# Altium schematic sheet STRWL-S04-V00-Microcontroller.SchDoc: STRWL Microcontroller
size A3; DrawnBy: John Hatfield; DocumentNumber: 4; Revision: 01; SheetNumber: 4; SheetTotal: 6; Version: 01; Project: STRWL QEV3; PageSetup: Record=PageOptions|CenterHorizontal=True|CenterVertical=True|PrintScale=0.97|XCorrection=1.00|YCorrection=1.00|PrintKind=0|BorderSize=5000000|LeftOffset=0|BottomOffset=0|Orientation=2|PaperLength=1000|PaperWidth=1000|Scale=100|PaperSource=7|PrintQuality=-4|MediaType=1|DitherType=10|PaperKind=A4|PrintScaleMode=1
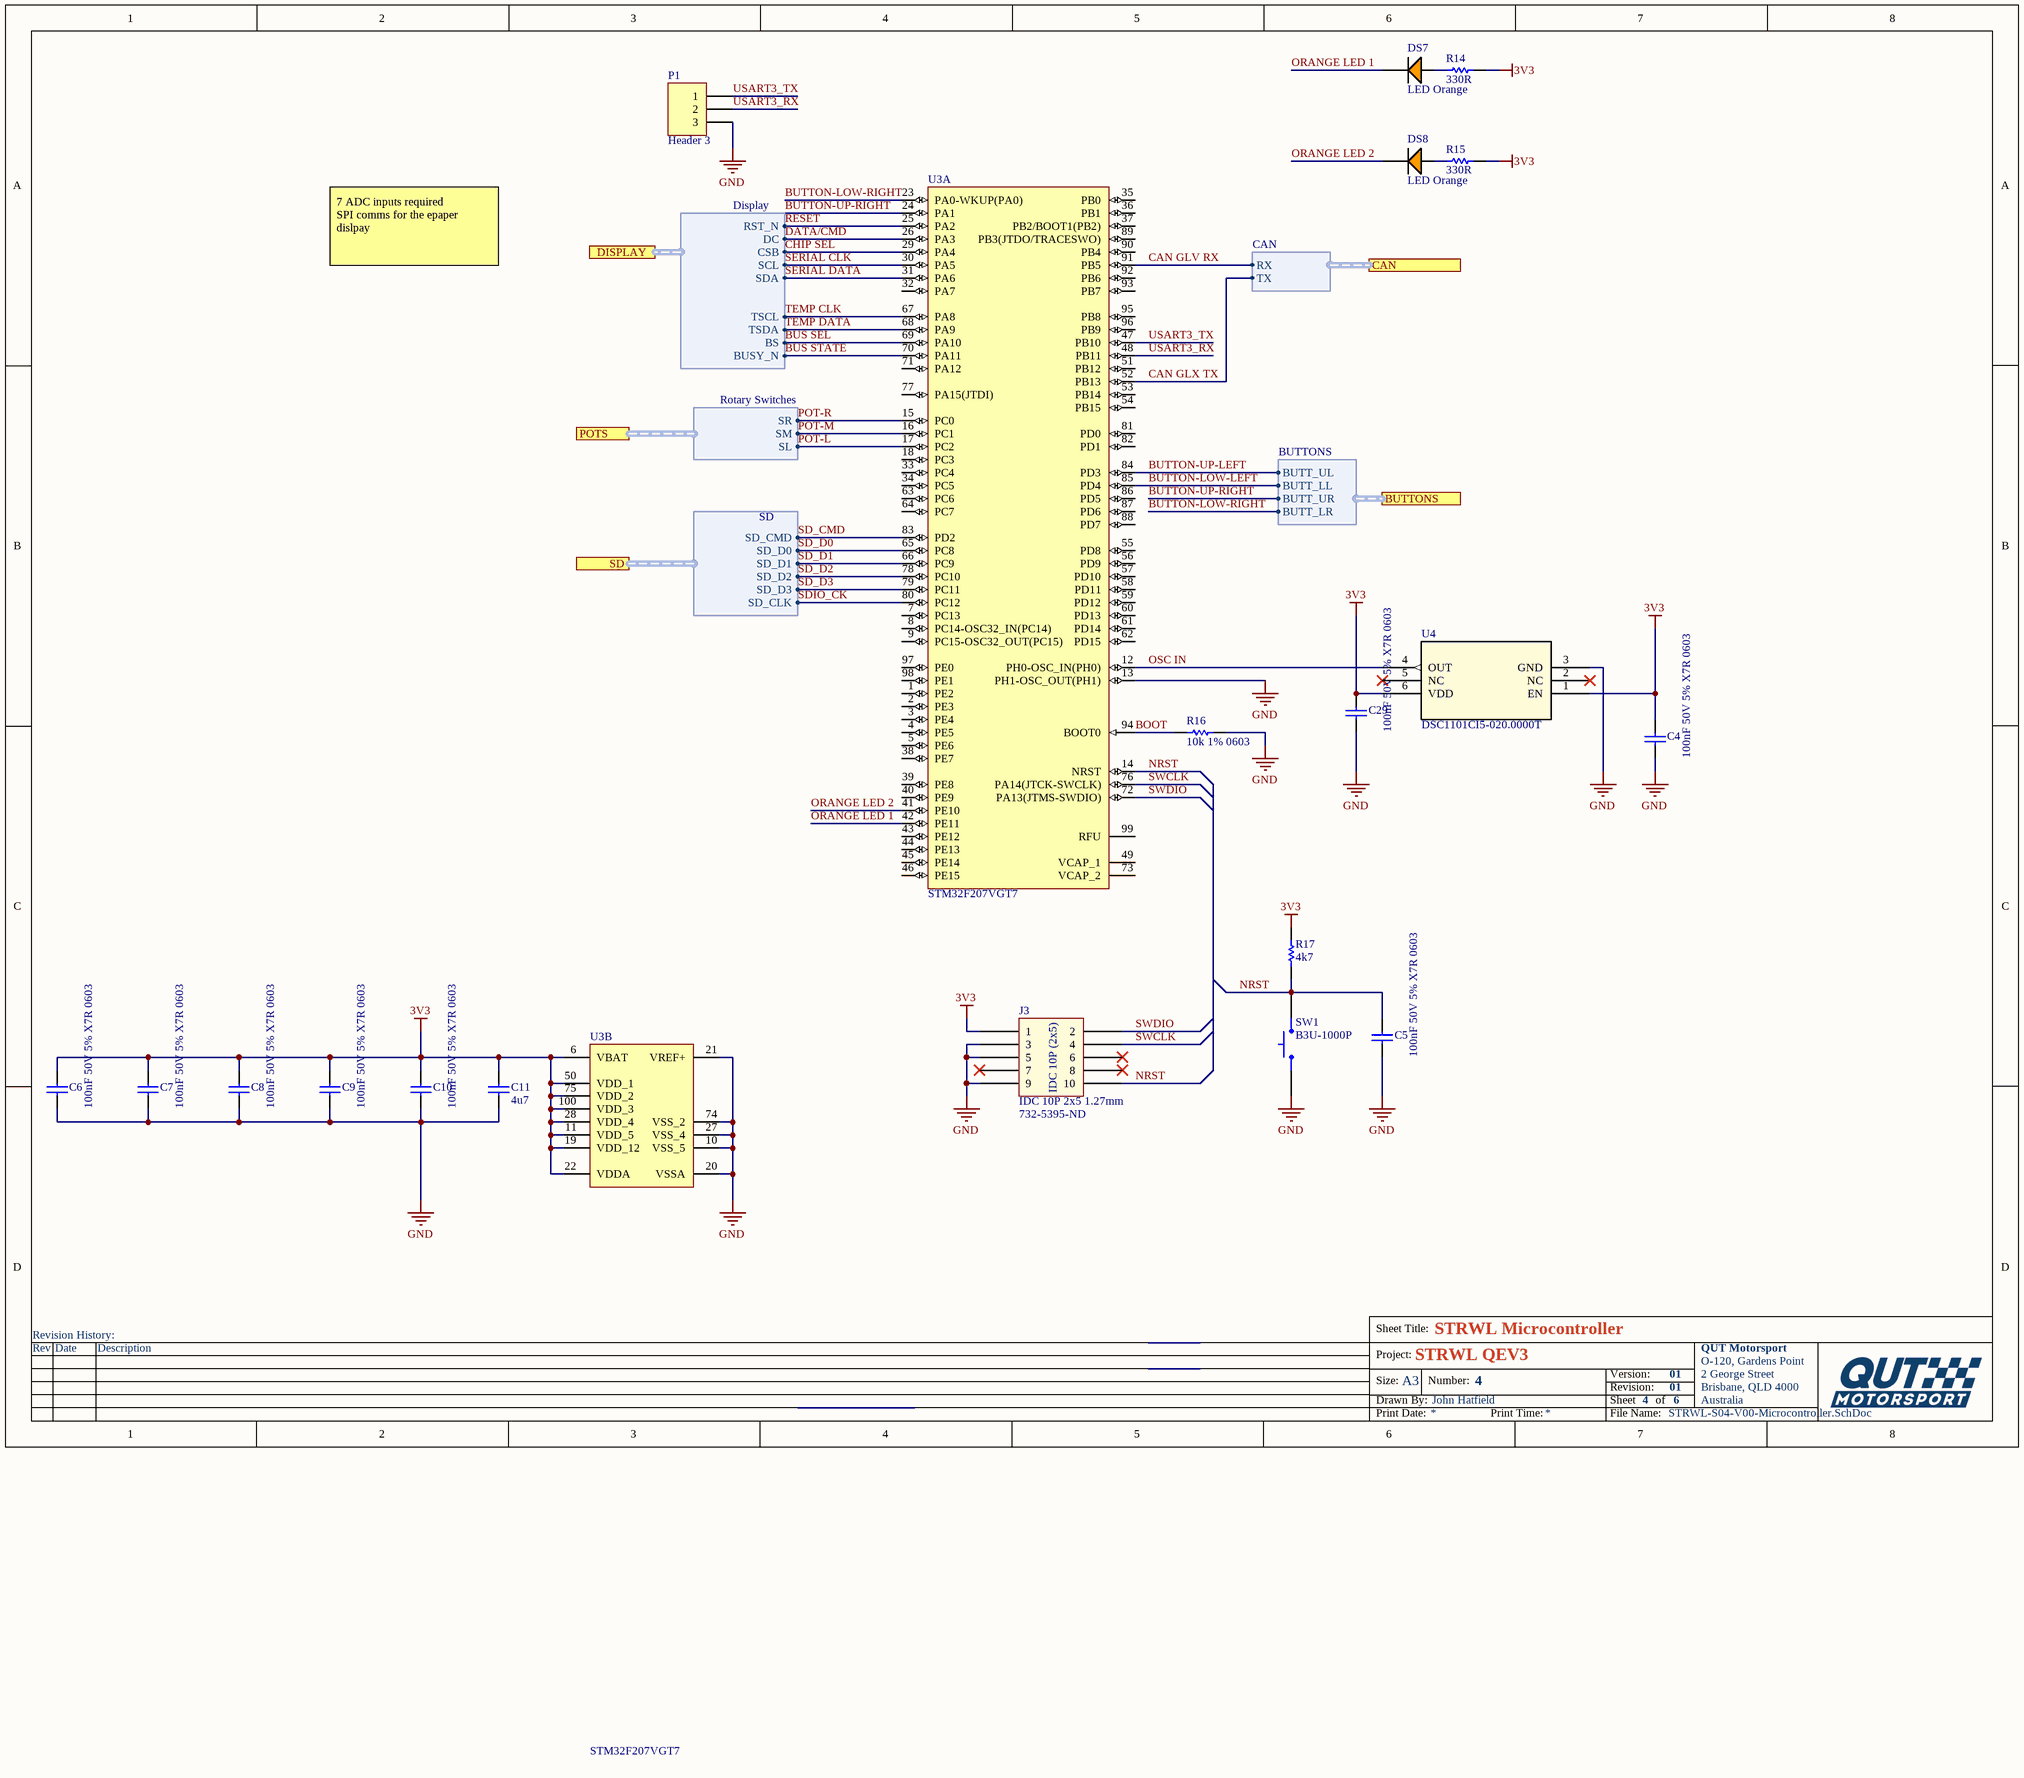
[diagram p0: STRWL-S04-V00-Microcontroller.SchDoc]

## Parts
C4  100nF 50V 5% X7R 0603  [Cap_Ceramic_0603]
C5  100nF 50V 5% X7R 0603  [Cap_Ceramic_0603]
C6  100nF 50V 5% X7R 0603  [Cap_Ceramic_0603]
C7  100nF 50V 5% X7R 0603  [Cap_Ceramic_0603]
C8  100nF 50V 5% X7R 0603  [Cap_Ceramic_0603]
C9  100nF 50V 5% X7R 0603  [Cap_Ceramic_0603]
C10  100nF 50V 5% X7R 0603  [Cap_Ceramic_0603]
C11  4u7  [Cap_Ceramic_0603]
C29  100nF 50V 5% X7R 0603  [Cap_Ceramic_0603]
DS7  LED Orange  [LED ORANGE 0603]
DS8  LED Orange  [LED ORANGE 0603]
J3  IDC 10P 2x5 1.27mm  [IDC 1.27MM 10P]
P1  Header 3  [HDR1X3]
R14  330R  [Res_ThinFilm_0603]
R15  330R  [Res_ThinFilm_0603]
R16  10k 1% 0603  [Res_ThinFilm_0603]
R17  4k7  [Res_ThinFilm_0603]
SW1  B3U-1000P  [BTN B3U-1000P]
U3  STM32F207VGT7  [STM-LQFP100_N]  (parts A,B of 2)
U4  DSC1101CI5-020.0000T  [VDFN6_3P2X2P5_MCH]

## Ports
BUTTONS (harness BUTTONS), CAN (harness CAN), DISPLAY (harness Display), POTS (harness Rotary Switches), SD (harness SD)

## Harnesses
SD: SD_D0, SD_D1, SD_D2, SD_D3, SD_CLK, SD_CMD
Display: RST_N, DC, CSB, SCL, SDA, TSCL, TSDA, BS, BUSY_N
BUTTONS: BUTT_UL, BUTT_LL, BUTT_UR, BUTT_LR
Rotary Switches: SL, SM, SR
CAN: RX, TX

## Nets
3V3: C4.2 C6.2 C7.2 C8.2 C9.2 C10.2 C11.2 C29.2 J3.1 R14.2 R15.2 R17.2 U3.6(VBAT) U3.11(VDD_5) U3.19(VDD_12) U3.22(VDDA) U3.28(VDD_4) U3.50(VDD_1) U3.75(VDD_2) U3.100(VDD_3) U4.1(EN) U4.6(VDD)
GND: C4.1 C5.1 C6.1 C7.1 C8.1 C9.1 C10.1 C11.1 C29.1 J3.3 J3.5 J3.9 P1.3 R16.2 SW1.1 U3.10(VSS_5) U3.13(PH1-OSC_OUT(PH1)) U3.20(VSSA) U3.21(VREF+) U3.27(VSS_4) U3.74(VSS_2) U4.3(GND)
BOOT: R16.1 U3.94(BOOT0)
BUS SEL: U3.69(PA10) ; port DISPLAY.BS
BUS STATE: U3.70(PA11) ; port DISPLAY.BUSY_N
BUTTON-LOW-LEFT: U3.85(PD4) ; port BUTTONS.BUTT_LL
BUTTON-LOW-RIGHT: U3.23(PA0-WKUP(PA0)) ; port BUTTONS.BUTT_LR
BUTTON-UP-LEFT: U3.84(PD3) ; port BUTTONS.BUTT_UL
BUTTON-UP-RIGHT: U3.24(PA1) ; port BUTTONS.BUTT_UR
CAN GLV RX: U3.91(PB5) ; port CAN.RX
CAN GLX TX: U3.52(PB13) ; port CAN.TX
CHIP SEL: U3.29(PA4) ; port DISPLAY.CSB
DATA/CMD: U3.26(PA3) ; port DISPLAY.DC
NRST: C5.2 J3.10 R17.1 SW1.2 U3.14(NRST)
ORANGE LED 1: DS7.2(C) U3.42(PE11)
ORANGE LED 2: DS8.2(C) U3.41(PE10)
OSC IN: U3.12(PH0-OSC_IN(PH0)) U4.4(OUT)
POT-L: U3.17(PC2) ; port POTS.SL
POT-M: U3.16(PC1) ; port POTS.SM
POT-R: U3.15(PC0) ; port POTS.SR
RESET: U3.25(PA2) ; port DISPLAY.RST_N
SD_CMD: U3.83(PD2) ; port SD.SD_CMD
SD_D0: U3.65(PC8) ; port SD.SD_D0
SD_D1: U3.66(PC9) ; port SD.SD_D1
SD_D2: U3.78(PC10) ; port SD.SD_D2
SD_D3: U3.79(PC11) ; port SD.SD_D3
SDIO_CK: U3.80(PC12) ; port SD.SD_CLK
SERIAL CLK: U3.30(PA5) ; port DISPLAY.SCL
SERIAL DATA: U3.31(PA6) ; port DISPLAY.SDA
SWCLK: J3.4 U3.76(PA14(JTCK-SWCLK))
SWDIO: J3.2 U3.72(PA13(JTMS-SWDIO))
TEMP CLK: U3.67(PA8) ; port DISPLAY.TSCL
TEMP DATA: U3.68(PA9) ; port DISPLAY.TSDA
USART3_RX: P1.2 U3.48(PB11)
USART3_TX: P1.1 U3.47(PB10)
NetDS7_1: DS7.1(A) R14.1
NetDS8_1: DS8.1(A) R15.1

Not connected (* = marked no-connect by the designer): J3 6* 7* 8*; U3 1(PE2) 2(PE3) 3(PE4) 4(PE5) 5(PE6) 7(PC13) 8(PC14-OSC32_IN(PC14)) 9(PC15-OSC32_OUT(PC15)) 18(PC3) 32(PA7) 33(PC4) 34(PC5) 35(PB0) 36(PB1) 37(PB2/BOOT1(PB2)) 38(PE7) 39(PE8) 40(PE9) 43(PE12) 44(PE13) 45(PE14) 46(PE15) 49(VCAP_1) 51(PB12) 53(PB14) 54(PB15) 55(PD8) 56(PD9) 57(PD10) 58(PD11) 59(PD12) 60(PD13) 61(PD14) 62(PD15) 63(PC6) 64(PC7) 71(PA12) 73(VCAP_2) 77(PA15(JTDI)) 81(PD0) 82(PD1) 86(PD5) 87(PD6) 88(PD7) 89(PB3(JTDO/TRACESWO)) 90(PB4) 92(PB6) 93(PB7) 95(PB8) 96(PB9) 97(PE0) 98(PE1) 99(RFU); U4 2(NC)* 5(NC)*

## Notes on the sheet
- 7 ADC inputs required
  SPI comms for the epaper dislpay
- (near J3) 732-5395-ND
- Revision History:
- Sheet Title:
- Rev
- Date
- Description
- Project:
- Size:
- Drawn By:
- A3
- Number:
- Revision:
- Sheet
- Version:
- of
- QUT Motorsport
- O-120, Gardens Point
- 2 George Street
- Brisbane, QLD 4000
- Australia
- Print Date:
- Print Time:
- File Name:
- (in symbol IDC 10P 2x5 1.27mm) IDC 10P (2x5)

## Library data of the parts
C4-C10 C29 = 100nF 50V 5% X7R 0603: Capacitor, Ceramic, SMD, 100nF, 50V, 5%, X7R, 0603
C11 = 4u7 50V 5% X7R 0603: Capacitor, Ceramic, SMD, 4u7, 50V, 5%, X7R, 0603
DS7 DS8 = LED ORANGE 0603
P1 = Header 3: Header, 3-Pin; LatestRevisionDate: 17-Jul-2002; LatestRevisionNote: Re-released for DXP Platform.; Publisher: Altium Limited
R14 R15 = 330R 5% 0603: Resistor, SMD, 330R, 0.1W, 5%, 0603
R16 = 20k 1% 0603: Resistor, SMD, 20k, 0.1W, 5%, 0603
R17 = 4k7 5% 0603: Resistor, SMD, 4k7, 0.1W, 5%, 0603
SW1 = BTN B3U-1000P: Omron B3U-1000P Ultra Miniture Switch; ComponentLink1Description: LCSC; ComponentLink1URL: https://lcsc.com/product-detail/Tactile-Switches_BRIGHT-TSA063G50-250_C294565.html
U3 = STM32F207VGT7-Custom: ARM Cortex-M3 32-bit MCU, 1024 KB Flash, 128 KB Internal RAM, 82 I/Os, 100-pin LQFP, -40 to 105 degC, Tray; D/A Converter: 2x12-bit (2 Channel); Internal RAM Size (kB): 128; Supply Voltage(Vcc) min (V): 1.8; I/Os (High Current): 82; Operating Frequency(F) (Processor speed) (MHz): 120; FLASH Size (Prog) (kB): 1024; PartNumber: STM32F207VGT7; DatasheetVersion: Rev. 9; Core: ARM Cortex-M3; ComponentLink3Description: Package Specification; ComponentLink3URL: http://www.st.com/st-web-ui/static/active/en/resource/technical/document/data_brief/DM00071938.pdf; PackageDescription: 100-Pin Low Profile Quad Flat Package, 14 x 14 mm Body, 0.5 mm Pitch; ComponentLink1Description: Manufacturer URL; PackageVersion: Rev. 1, 06/2013; ComponentLink1URL: http://www.st.com/web/en/home.html; PackageReference: LQFP100; ComponentLink2Description: Datasheet; ComponentLink2URL: http://www.st.com/st-web-ui/static/active/en/resource/technical/document/datasheet/CD00237391.pdf; Mounting Technology: Surface Mount; Packing: Tray
U4 = DSC1101CI5-020.0000T: No Description Available; Vendor: Microchip; Built_By: EMA_Jessica; SourceLibrary: Microchip_2019-08-23_23; Manufacturer_Part_Number: DSC1101CI5-020.0000T; Copyright: Copyright (C) 2018 Accelerated Designs. All rights reserved; RefDes: RefDes; Type: DEV